# Altium schematic sheet Current input.SchDoc
size A4
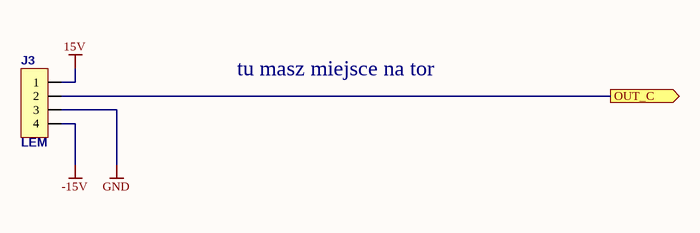
[diagram p0: Current input.SchDoc]

## Parts
J3  LEM  [15EDGRC-3.5/4P_WO_CN]

## Ports
OUT_C (out)

## Nets
15V: J3.1
-15V: J3.4
GND: J3.3
OUT_C: J3.2 ; port OUT_C

## Notes on the sheet
- tu masz miejsce na tor

## Library data of the parts
J3 = 15EDGRC-3.5/4P: Degson 7A, 250V, 4 Pole Plug-in Terminal Block